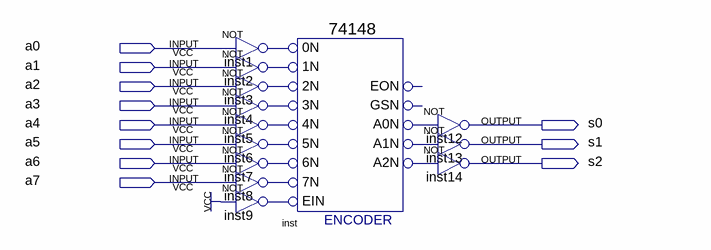
[diagram p0: schematic sheet]
// Quartus schematic Encoder8x3.bdf as structural Verilog: 13 symbols, 11 pins
module Encoder8x3 (
  input  a0,
  input  a1,
  input  a2,
  input  a3,
  input  a4,
  input  a5,
  input  a6,
  input  a7,
  output s0,
  output s1,
  output s2
);

  wire inst1_out, inst2_out, inst3_out, inst4_out, inst5_out, inst6_out, inst7_out, inst8_out, inst9_out,
       inst_a0n, inst_a1n, inst_a2n;

  not inst1 (inst1_out, a0);
  not inst2 (inst2_out, a1);
  not inst3 (inst3_out, a2);
  not inst4 (inst4_out, a3);
  not inst5 (inst5_out, a4);
  not inst6 (inst6_out, a5);
  not inst7 (inst7_out, a6);
  not inst8 (inst8_out, a7);
  not inst9 (inst9_out, 1'b1);
  \74148  inst (
    .\5N (inst6_out), .\0N (inst1_out), .\1N (inst2_out), .\2N (inst3_out), .\3N (inst4_out),
    .\4N (inst5_out), .EIN(inst9_out), .\6N (inst7_out), .\7N (inst8_out), .A1N(inst_a1n), .A0N(inst_a0n),
    .A2N(inst_a2n));  // open: EON, GSN
  not inst12 (s0, inst_a0n);
  not inst13 (s1, inst_a1n);
  not inst14 (s2, inst_a2n);
endmodule
